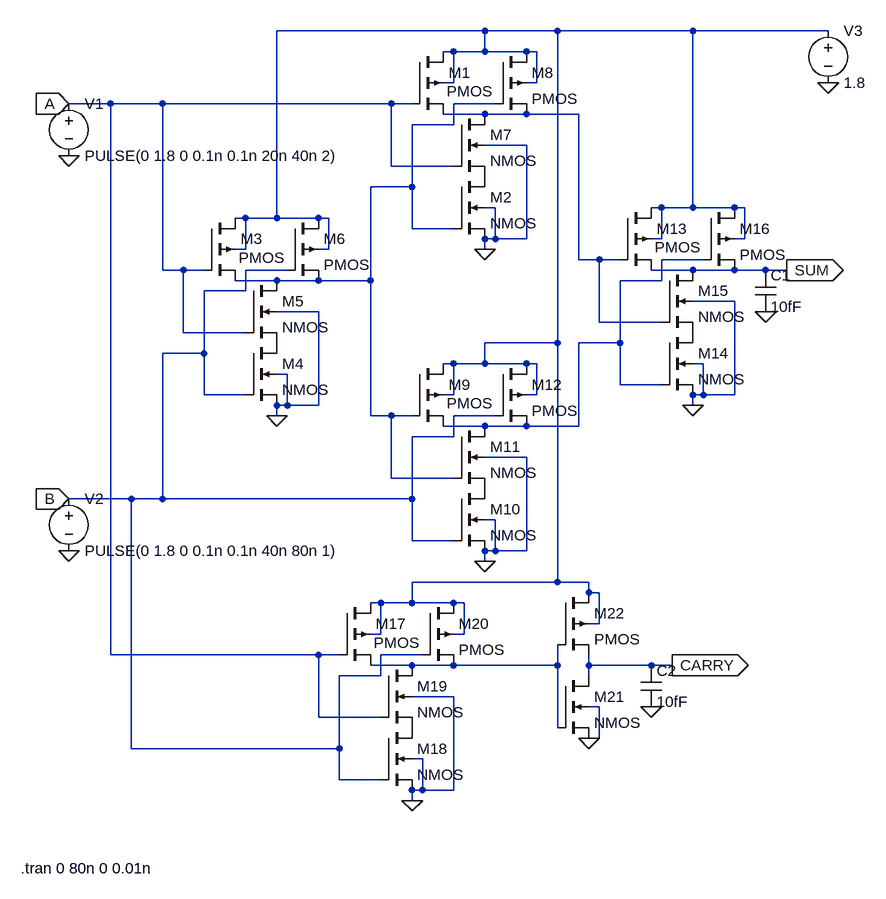
[diagram p0: schematic half-adder.asc]
half-adder.asc, the LTspice schematic file:
Version 4
SHEET 1 1080 1172
WIRE 112 -208 -208 -208
WIRE 224 -208 112 -208
WIRE 432 -208 224 -208
WIRE 640 -208 432 -208
WIRE 64 -176 48 -176
WIRE 112 -176 112 -208
WIRE 112 -176 64 -176
WIRE 176 -176 112 -176
WIRE 192 -176 176 -176
WIRE 64 -128 64 -176
WIRE 64 -128 48 -128
WIRE 192 -128 192 -176
WIRE 192 -128 176 -128
WIRE -464 -96 -528 -96
WIRE -384 -96 -464 -96
WIRE -32 -96 -384 -96
WIRE 0 -96 -32 -96
WIRE 128 -96 64 -96
WIRE 112 -80 48 -80
WIRE 176 -80 112 -80
WIRE 256 -80 176 -80
WIRE 64 -64 64 -96
WIRE 64 -64 0 -64
WIRE 176 -32 112 -32
WIRE -32 0 -32 -96
WIRE 64 0 -32 0
WIRE 0 32 0 -64
WIRE 0 32 -64 32
WIRE 128 64 112 64
WIRE 384 64 368 64
WIRE 432 64 432 -208
WIRE 432 64 384 64
WIRE 496 64 432 64
WIRE 512 64 496 64
WIRE -256 80 -272 80
WIRE -208 80 -208 -208
WIRE -208 80 -256 80
WIRE -144 80 -208 80
WIRE -128 80 -144 80
WIRE 0 96 0 32
WIRE 64 96 0 96
WIRE 128 112 128 64
WIRE 128 112 112 112
WIRE 176 112 176 -32
WIRE 176 112 128 112
WIRE 384 112 384 64
WIRE 384 112 368 112
WIRE 512 112 512 64
WIRE 512 112 496 112
WIRE -256 128 -256 80
WIRE -256 128 -272 128
WIRE -128 128 -128 80
WIRE -128 128 -144 128
WIRE 112 128 112 112
WIRE 256 144 256 -80
WIRE 288 144 256 144
WIRE 320 144 288 144
WIRE 448 144 384 144
WIRE -384 160 -384 -96
WIRE -352 160 -384 160
WIRE -320 160 -352 160
WIRE -192 160 -256 160
WIRE 432 160 368 160
WIRE 496 160 432 160
WIRE 544 160 496 160
WIRE 576 160 544 160
WIRE -208 176 -272 176
WIRE -144 176 -208 176
WIRE -64 176 -64 32
WIRE -64 176 -144 176
WIRE 384 176 384 144
WIRE 384 176 320 176
WIRE -256 192 -256 160
WIRE -256 192 -320 192
WIRE 496 208 432 208
WIRE -144 224 -208 224
WIRE 288 240 288 144
WIRE 384 240 288 240
WIRE -352 256 -352 160
WIRE -256 256 -352 256
WIRE 224 272 224 -208
WIRE 224 272 112 272
WIRE 320 272 320 176
WIRE 320 272 256 272
WIRE -320 288 -320 192
WIRE -320 288 -384 288
WIRE 64 304 48 304
WIRE 112 304 112 272
WIRE 112 304 64 304
WIRE 176 304 112 304
WIRE 192 304 176 304
WIRE 448 304 432 304
WIRE -192 320 -208 320
WIRE 320 336 320 272
WIRE 384 336 320 336
WIRE -320 352 -320 288
WIRE -256 352 -320 352
WIRE 64 352 64 304
WIRE 64 352 48 352
WIRE 192 352 192 304
WIRE 192 352 176 352
WIRE 448 352 448 304
WIRE 448 352 432 352
WIRE 496 352 496 208
WIRE 496 352 448 352
WIRE -192 368 -192 320
WIRE -192 368 -208 368
WIRE -144 368 -144 224
WIRE -144 368 -192 368
WIRE 432 368 432 352
WIRE -208 384 -208 368
WIRE -64 384 -64 176
WIRE -32 384 -64 384
WIRE 0 384 -32 384
WIRE 128 384 64 384
WIRE 112 400 48 400
WIRE 176 400 112 400
WIRE 256 400 256 272
WIRE 256 400 176 400
WIRE 64 416 64 384
WIRE 64 416 0 416
WIRE 176 448 112 448
WIRE -32 480 -32 384
WIRE 64 480 -32 480
WIRE -432 512 -528 512
WIRE -384 512 -384 288
WIRE -384 512 -432 512
WIRE 0 512 0 416
WIRE 0 512 -384 512
WIRE 128 544 112 544
WIRE 0 576 0 512
WIRE 64 576 0 576
WIRE 128 592 128 544
WIRE 128 592 112 592
WIRE 176 592 176 448
WIRE 176 592 128 592
WIRE 112 608 112 592
WIRE 224 640 224 272
WIRE 224 640 0 640
WIRE 272 640 224 640
WIRE 272 656 272 640
WIRE 288 656 272 656
WIRE -48 672 -64 672
WIRE 0 672 0 640
WIRE 0 672 -48 672
WIRE 64 672 0 672
WIRE 80 672 64 672
WIRE 288 704 288 656
WIRE 288 704 272 704
WIRE -48 720 -48 672
WIRE -48 720 -64 720
WIRE 80 720 80 672
WIRE 80 720 64 720
WIRE -464 752 -464 -96
WIRE -144 752 -464 752
WIRE -112 752 -144 752
WIRE 16 752 -48 752
WIRE 0 768 -64 768
WIRE 64 768 0 768
WIRE 224 768 224 736
WIRE 224 768 64 768
WIRE 272 768 272 752
WIRE 368 768 272 768
WIRE 400 768 368 768
WIRE -48 784 -48 752
WIRE -48 784 -112 784
WIRE 272 784 272 768
WIRE 64 816 0 816
WIRE 288 832 272 832
WIRE -144 848 -144 752
WIRE -48 848 -144 848
WIRE 224 864 224 768
WIRE 288 880 288 832
WIRE 288 880 272 880
WIRE -432 896 -432 512
WIRE -112 896 -112 784
WIRE -112 896 -432 896
WIRE 16 912 0 912
WIRE -112 944 -112 896
WIRE -48 944 -112 944
WIRE 16 960 16 912
WIRE 16 960 0 960
WIRE 64 960 64 816
WIRE 64 960 16 960
WIRE 0 976 0 960
FLAG -208 384 0
FLAG 112 128 0
FLAG 112 608 0
FLAG 432 368 0
FLAG 0 976 0
FLAG -528 -16 0
FLAG -528 592 0
FLAG 576 160 SUM
IOPIN 576 160 Out
FLAG 400 768 CARRY
IOPIN 400 768 Out
FLAG -528 -96 A
IOPIN -528 -96 In
FLAG -528 512 B
IOPIN -528 512 In
FLAG 544 224 0
FLAG 368 832 0
FLAG 640 -128 0
FLAG 272 880 0
SYMBOL pmos4 -320 80 R0
WINDOW 3 53 61 Left 2
SYMATTR InstName M3
SYMATTR Value2 l=180n w=810n
SYMBOL nmos4 -256 272 R0
SYMATTR InstName M4
SYMATTR Value2 l=180n w=270n
SYMBOL nmos4 -256 176 R0
SYMATTR InstName M5
SYMATTR Value2 l=180n w=270n
SYMBOL pmos4 -192 80 R0
SYMATTR InstName M6
SYMATTR Value2 l=180n w=810n
SYMBOL pmos4 0 -176 R0
WINDOW 3 53 61 Left 2
SYMATTR InstName M1
SYMATTR Value2 l=180n w=810n
SYMBOL nmos4 64 16 R0
SYMATTR InstName M2
SYMATTR Value2 l=180n w=270n
SYMBOL nmos4 64 -80 R0
SYMATTR InstName M7
SYMATTR Value2 l=180n w=270n
SYMBOL pmos4 128 -176 R0
SYMATTR InstName M8
SYMATTR Value2 l=180n w=810n
SYMBOL pmos4 0 304 R0
WINDOW 3 53 61 Left 2
SYMATTR InstName M9
SYMATTR Value2 l=180n w=810n
SYMBOL nmos4 64 496 R0
SYMATTR InstName M10
SYMATTR Value2 l=180n w=270n
SYMBOL nmos4 64 400 R0
SYMATTR InstName M11
SYMATTR Value2 l=180n w=270n
SYMBOL pmos4 128 304 R0
SYMATTR InstName M12
SYMATTR Value2 l=180n w=810n
SYMBOL pmos4 320 64 R0
WINDOW 3 53 61 Left 2
SYMATTR InstName M13
SYMATTR Value2 l=180n w=810n
SYMBOL nmos4 384 256 R0
SYMATTR InstName M14
SYMATTR Value2 l=180n w=270n
SYMBOL nmos4 384 160 R0
SYMATTR InstName M15
SYMATTR Value2 l=180n w=270n
SYMBOL pmos4 448 64 R0
SYMATTR InstName M16
SYMATTR Value2 l=180n w=810n
SYMBOL pmos4 -112 672 R0
WINDOW 3 53 61 Left 2
SYMATTR InstName M17
SYMATTR Value2 l=180n w=810n
SYMBOL nmos4 -48 864 R0
SYMATTR InstName M18
SYMATTR Value2 l=180n w=270n
SYMBOL nmos4 -48 768 R0
SYMATTR InstName M19
SYMATTR Value2 l=180n w=270n
SYMBOL pmos4 16 672 R0
SYMATTR InstName M20
SYMATTR Value2 l=180n w=810n
SYMBOL pmos4 224 656 R0
SYMATTR InstName M22
SYMATTR Value2 l=180n w=810n
SYMBOL voltage -528 -112 R0
WINDOW 123 0 0 Left 0
WINDOW 39 0 0 Left 0
SYMATTR InstName V1
SYMATTR Value PULSE(0 1.8 0 0.1n 0.1n 20n 40n 2)
SYMBOL voltage -528 496 R0
WINDOW 123 0 0 Left 0
WINDOW 39 0 0 Left 0
SYMATTR InstName V2
SYMATTR Value PULSE(0 1.8 0 0.1n 0.1n 40n 80n 1)
SYMBOL voltage 640 -224 R0
WINDOW 123 0 0 Left 0
WINDOW 39 0 0 Left 0
SYMATTR InstName V3
SYMATTR Value 1.8
SYMBOL cap 528 160 R0
SYMATTR InstName C1
SYMATTR Value 10fF
SYMBOL cap 352 768 R0
SYMATTR InstName C2
SYMATTR Value 10fF
SYMBOL nmos4 224 784 R0
SYMATTR InstName M21
SYMATTR Value2 l=180n w=270n
TEXT -602 1080 Left 2 !.tran 0 80n 0 0.01n

The netlist it stands for:
* half-adder.asc
M3 N001 A N002 N001 PMOS l=180n w=810n
M4 P001 B 0 0 NMOS l=180n w=270n
M5 N002 A P001 0 NMOS l=180n w=270n
M6 N001 B N002 N001 PMOS l=180n w=810n
M1 N001 A N003 N001 PMOS l=180n w=810n
M2 P002 N002 0 0 NMOS l=180n w=270n
M7 N003 A P002 0 NMOS l=180n w=270n
M8 N001 N002 N003 N001 PMOS l=180n w=810n
M9 N001 N002 N004 N001 PMOS l=180n w=810n
M10 P003 B 0 0 NMOS l=180n w=270n
M11 N004 N002 P003 0 NMOS l=180n w=270n
M12 N001 B N004 N001 PMOS l=180n w=810n
M13 N001 N003 SUM N001 PMOS l=180n w=810n
M14 P004 N004 0 0 NMOS l=180n w=270n
M15 SUM N003 P004 0 NMOS l=180n w=270n
M16 N001 N004 SUM N001 PMOS l=180n w=810n
M17 N001 A N005 N001 PMOS l=180n w=810n
M18 P005 B 0 0 NMOS l=180n w=270n
M19 N005 A P005 0 NMOS l=180n w=270n
M20 N001 B N005 N001 PMOS l=180n w=810n
M22 N001 N005 CARRY N001 PMOS l=180n w=810n
V1 A 0 PULSE(0 1.8 0 0.1n 0.1n 20n 40n 2)
V2 B 0 PULSE(0 1.8 0 0.1n 0.1n 40n 80n 1)
V3 N001 0 1.8
C1 SUM 0 10fF
C2 CARRY 0 10fF
M21 CARRY N005 0 0 NMOS l=180n w=270n
.model NMOS NMOS
.model PMOS PMOS
.lib standard.mos
.tran 0 80n 0 0.01n
.backanno
.end